# Altium schematic sheet Seven-Seg Displays.SchDoc
size A4; Organization: Machine Intellgence Laboratory; Des1: This board uses a 4-digit; Des2: seven-segment display to show; Des3: battery voltage & current draw.; SheetNumber: 5; SheetTotal: 5; Author1: Russell MacGregor; VersionControl_Repository: BatteryMonitorSpring2025
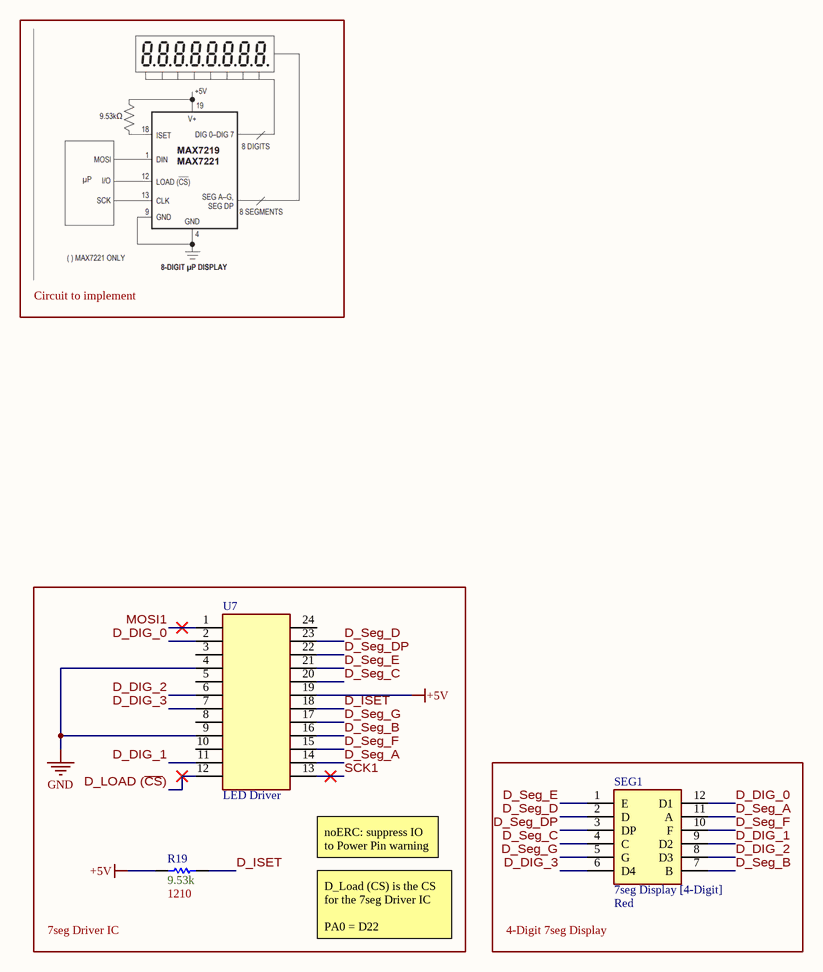
[diagram p0: Seven-Seg Displays.SchDoc]

## Parts
R19  Resistance: 9.53k  Size Package: 1210  [SMD Resistor [1210]]  (hidden comment: SMD Resistor)
SEG1  7seg Display [4-Digit]  Color: Red  [7seg Display [4 Digit]]
U7  LED Driver  [DIP IC [24pin, IC]]

## Blocks framed on the sheet
7seg Driver IC: R19 U7
4-Digit 7seg Display: SEG1

## Nets
+5V: R19.1 U7.19(V+)
GND: U7.4(GND) U7.9(GND)
D_DIG_0: SEG1.12(D1) U7.2(DIG0)
D_DIG_1: SEG1.9(D2) U7.11(DIG1)
D_DIG_2: SEG1.8(D3) U7.6(DIG2)
D_DIG_3: SEG1.6(D4) U7.7(DIG3)
D_ISET: R19.2 U7.18(ISET)
D_LOAD (~{CS}): U7.12(LOAD_(~{CS}))
D_Seg_A: SEG1.11(A) U7.14(SEGA)
D_Seg_B: SEG1.7(B) U7.16(SEGB)
D_Seg_C: SEG1.4(C) U7.20(SEGC)
D_Seg_D: SEG1.2(D) U7.23(SEGD)
D_Seg_DP: SEG1.3(DP) U7.22(SEGDP)
D_Seg_E: SEG1.1(E) U7.21(SEGE)
D_Seg_F: SEG1.10(F) U7.15(SEGF)
D_Seg_G: SEG1.5(G) U7.17(SEGG)
MOSI1: U7.1(DIN)
SCK1: U7.13(CLK)

Not connected (* = marked no-connect by the designer): U7 3(DIG4) 5(DIG6) 8(DIG7) 10(DIG5) 24(DOUT)

## Notes on the sheet
- Circuit to implement
- (near U7) noERC: suppress IO to Power Pin warning
- D_Load (CS) is the CS for the 7seg Driver IC
  PA0 = D22
- Project/Vehicle:
- Author(s):
- -
- Revisor(s):
- Git Repo:
- Git Hash:
- Date:
- Revision:
- Size:
- A4
- File:
- Sheet
- of

## Library data of the parts
R19 = SMD Resistor: JLC Part #: C728401 / (for 1M Ohm Res); JLC Part #: C728401; Mouser Part #: ERJ-14NF9531U
U7 = DIP IC [24pin]: Mouser Part #: 700-MAX7219ENG
SEG1 = 7seg Display [4-Digit]: Mouser Part #: 474-COM-11405